# Altium schematic sheet mbed_programmer_2.SchDoc: mbed_programmer
size 298 x 212 mm; Date: 10.06.2016 15:21:44; SheetNumber: 3
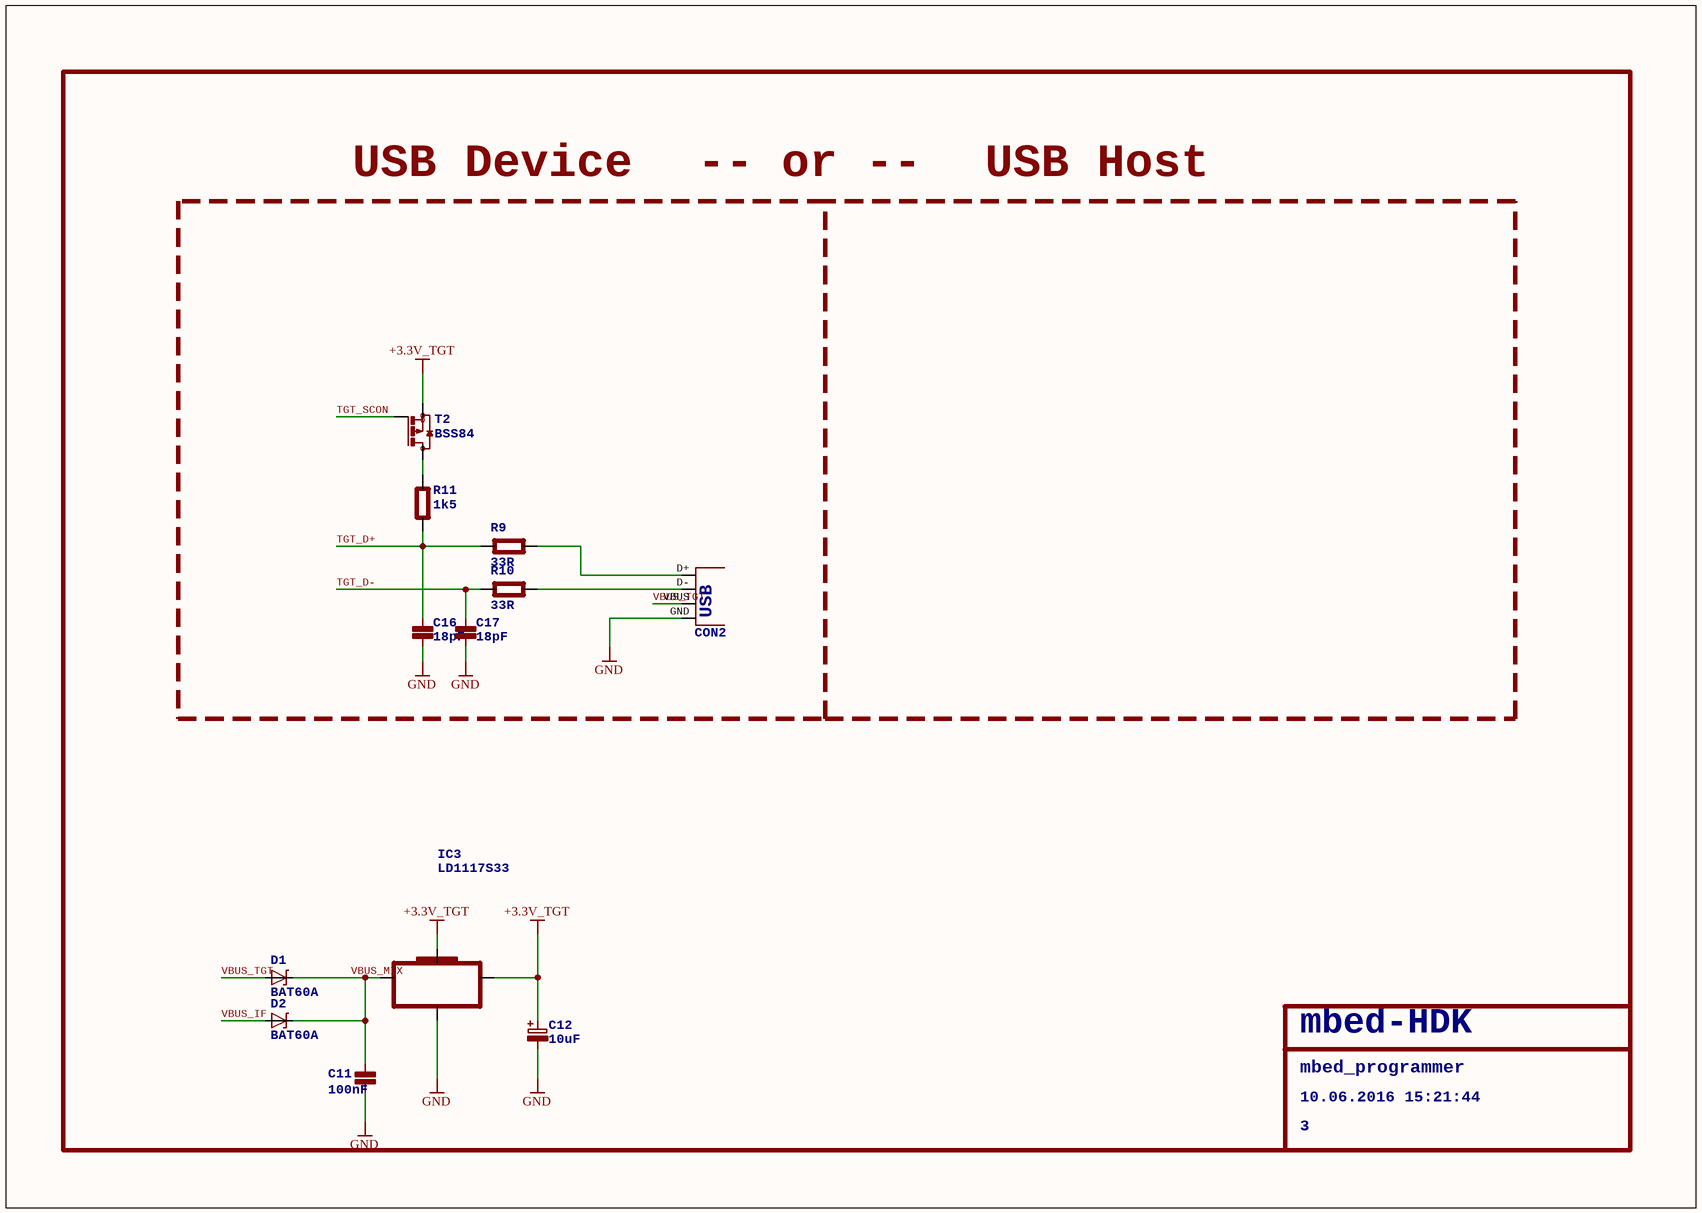
[diagram p0: mbed_programmer_2.SchDoc]

## Parts
C11  100nF  [0603]
C12  10uF  [CASE-B]
C16  18pF  [0603]
C17  18pF  [0603]
CON2  USB-MB-S  [USB-MB-S]  (value not drawn)
D1  BAT60A  [BAT60A]
D2  BAT60A  [BAT60A]
IC3  LD1117S33  [SOT223]
R9  33R  [0603]
R10  33R  [0603]
R11  1k5  [0603]
T2  BSS84  [SOT23]

## Nets
+3.3V_TGT: C12.1 IC3.2(OUT) IC3.4(K) T2.2(S)
GND: C11.2(P$2) C12.2 C16.2(P$2) C17.2(P$2) CON2.GND IC3.1(GND)
TGT_D+: C16.1(P$1) R9.1(P$1) R11.2(P$2)
TGT_D-: C17.1(P$1) R10.1(P$1)
TGT_SCON: T2.1(G)
VBUS_IF: D2.A
VBUS_MIX: C11.1(P$1) D1.K D2.K IC3.3(IN)
VBUS_TGT: CON2.VBUS D1.A
NetCON2_D+: CON2.D+ R9.2(P$2)
NetCON2_D-: CON2.D- R10.2(P$2)
NetR11_1: R11.1(P$1) T2.3(D)

## Notes on the sheet
- USB Device
- -- or --
- USB Host
- mbed_programmer
- mbed-HDK
- 10.06.2016 15:21:44
- 3

## Library data of the parts
C11 C16 C17 = C0603
C12 = C-POLB
CON2 = USB-MB-S: USB Connectors; USB: USB
IC3 = LD1117S33: VOLTAGE REGULATOR SMD 3,3V
R9-R11 = R0603
T2 = BSS84: P-CHANNEL MOS FET